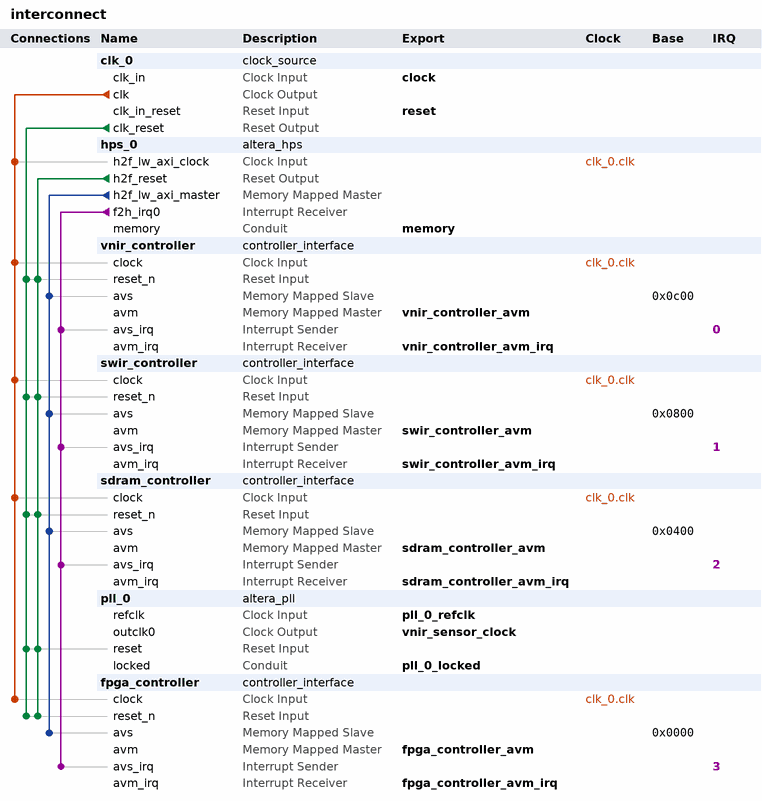
[diagram p0: system contents]
# Platform Designer (Qsys) system interconnect, Cyclone V 5CSXFC6D6F31C6
# Parameters at their usual value, and those the tool derives, are not listed.
package require -exact qsys 17.0
create_system interconnect
set_project_property DEVICE_FAMILY {Cyclone V}
set_project_property DEVICE 5CSXFC6D6F31C6

add_instance clk_0 clock_source 17.0
set_instance_parameter_value clk_0 clockFrequency 50000000

add_instance hps_0 altera_hps 17.0
set_instance_parameter_value hps_0 EMAC1_Mode N/A
set_instance_parameter_value hps_0 EMAC1_PinMuxing Unused
set_instance_parameter_value hps_0 F2SCLK_COLDRST_Enable false
set_instance_parameter_value hps_0 F2SCLK_DBGRST_Enable false
set_instance_parameter_value hps_0 F2SCLK_WARMRST_Enable false
set_instance_parameter_value hps_0 F2SINTERRUPT_Enable true
set_instance_parameter_value hps_0 F2S_Width 0
set_instance_parameter_value hps_0 FPGA_PERIPHERAL_OUTPUT_CLOCK_FREQ_EMAC0_GTX_CLK 125
set_instance_parameter_value hps_0 FPGA_PERIPHERAL_OUTPUT_CLOCK_FREQ_EMAC0_MD_CLK 2.5
set_instance_parameter_value hps_0 FPGA_PERIPHERAL_OUTPUT_CLOCK_FREQ_EMAC1_GTX_CLK 125
set_instance_parameter_value hps_0 FPGA_PERIPHERAL_OUTPUT_CLOCK_FREQ_EMAC1_MD_CLK 2.5
set_instance_parameter_value hps_0 HPS_PROTOCOL DDR3
set_instance_parameter_value hps_0 I2C0_Mode N/A
set_instance_parameter_value hps_0 I2C0_PinMuxing Unused
set_instance_parameter_value hps_0 I2C1_Mode N/A
set_instance_parameter_value hps_0 I2C1_PinMuxing Unused
set_instance_parameter_value hps_0 LWH2F_Enable true
set_instance_parameter_value hps_0 MEM_BANKADDR_WIDTH 3
set_instance_parameter_value hps_0 MEM_CLK_FREQ 400.0
set_instance_parameter_value hps_0 MEM_COL_ADDR_WIDTH 10
set_instance_parameter_value hps_0 MEM_DQ_WIDTH 32
set_instance_parameter_value hps_0 MEM_DRV_STR RZQ/7
set_instance_parameter_value hps_0 MEM_ROW_ADDR_WIDTH 15
set_instance_parameter_value hps_0 MEM_RTT_NOM RZQ/4
set_instance_parameter_value hps_0 MEM_RTT_WR RZQ/4
set_instance_parameter_value hps_0 MEM_TCL 11
set_instance_parameter_value hps_0 MEM_TFAW_NS 30.0
set_instance_parameter_value hps_0 MEM_TRAS_NS 35.0
set_instance_parameter_value hps_0 MEM_TRCD_NS 13.75
set_instance_parameter_value hps_0 MEM_TRFC_NS 260.0
set_instance_parameter_value hps_0 MEM_TRP_NS 13.75
set_instance_parameter_value hps_0 MEM_VENDOR Other
set_instance_parameter_value hps_0 MEM_WTCL 8
set_instance_parameter_value hps_0 QSPI_Mode N/A
set_instance_parameter_value hps_0 QSPI_PinMuxing Unused
set_instance_parameter_value hps_0 REF_CLK_FREQ 25.0
set_instance_parameter_value hps_0 S2FCLK_USER2CLK 5
set_instance_parameter_value hps_0 S2F_Width 0
set_instance_parameter_value hps_0 SDIO_Mode N/A
set_instance_parameter_value hps_0 SDIO_PinMuxing Unused
set_instance_parameter_value hps_0 SPIM1_Mode N/A
set_instance_parameter_value hps_0 SPIM1_PinMuxing Unused
set_instance_parameter_value hps_0 STM_Enable false
set_instance_parameter_value hps_0 TIMING_BOARD_AC_SKEW 0.02
set_instance_parameter_value hps_0 TIMING_BOARD_AC_TO_CK_SKEW 0.01
set_instance_parameter_value hps_0 TIMING_BOARD_DQ_TO_DQS_SKEW 0.05
set_instance_parameter_value hps_0 TIMING_BOARD_MAX_CK_DELAY 0.03
set_instance_parameter_value hps_0 TIMING_BOARD_MAX_DQS_DELAY 0.02
set_instance_parameter_value hps_0 TIMING_BOARD_SKEW_BETWEEN_DQS 0.06
set_instance_parameter_value hps_0 TIMING_BOARD_SKEW_CKDQS_DIMM_MAX 0.12
set_instance_parameter_value hps_0 TIMING_BOARD_SKEW_CKDQS_DIMM_MIN 0.06
set_instance_parameter_value hps_0 TIMING_BOARD_SKEW_WITHIN_DQS 0.01
set_instance_parameter_value hps_0 TIMING_TDH 5
set_instance_parameter_value hps_0 TIMING_TDQSCK 255
set_instance_parameter_value hps_0 TIMING_TDQSQ 125
set_instance_parameter_value hps_0 TIMING_TDS 30
set_instance_parameter_value hps_0 TIMING_TIH 140
set_instance_parameter_value hps_0 TIMING_TIS 180
set_instance_parameter_value hps_0 TIMING_TQSH 0.4
set_instance_parameter_value hps_0 UART0_Mode N/A
set_instance_parameter_value hps_0 UART0_PinMuxing Unused
set_instance_parameter_value hps_0 USB1_Mode N/A
set_instance_parameter_value hps_0 USB1_PinMuxing Unused
set_instance_parameter_value hps_0 desired_cfg_clk_mhz 100.0
set_instance_parameter_value hps_0 desired_qspi_clk_mhz 400.0
set_instance_parameter_value hps_0 use_default_mpu_clk false

add_instance vnir_controller controller_interface 1.0

add_instance swir_controller controller_interface 1.0

add_instance sdram_controller controller_interface 1.0

add_instance pll_0 altera_pll 17.0
set_instance_parameter_value pll_0 gui_device_speed_grade 1
set_instance_parameter_value pll_0 gui_number_of_clocks 1
set_instance_parameter_value pll_0 gui_operation_mode direct
set_instance_parameter_value pll_0 gui_output_clock_frequency0 48.0
set_instance_parameter_value pll_0 gui_pll_auto_reset On
set_instance_parameter_value pll_0 gui_pll_mode {Integer-N PLL}
set_instance_parameter_value pll_0 gui_reference_clock_frequency 50.0
set_instance_parameter_value pll_0 gui_use_locked true

add_instance fpga_controller controller_interface 1.0

# connections
add_connection clk_0.clk fpga_controller.clock clock
add_connection clk_0.clk hps_0.h2f_lw_axi_clock clock
add_connection clk_0.clk sdram_controller.clock clock
add_connection clk_0.clk swir_controller.clock clock
add_connection clk_0.clk vnir_controller.clock clock
add_connection clk_0.clk_reset fpga_controller.reset_n reset
add_connection clk_0.clk_reset pll_0.reset reset
add_connection clk_0.clk_reset sdram_controller.reset_n reset
add_connection clk_0.clk_reset swir_controller.reset_n reset
add_connection clk_0.clk_reset vnir_controller.reset_n reset
add_connection hps_0.h2f_reset fpga_controller.reset_n reset
add_connection hps_0.h2f_reset pll_0.reset reset
add_connection hps_0.h2f_reset sdram_controller.reset_n reset
add_connection hps_0.h2f_reset swir_controller.reset_n reset
add_connection hps_0.h2f_reset vnir_controller.reset_n reset
add_connection hps_0.h2f_lw_axi_master fpga_controller.avs avalon
set_connection_parameter_value hps_0.h2f_lw_axi_master/fpga_controller.avs baseAddress 0x0000
add_connection hps_0.h2f_lw_axi_master sdram_controller.avs avalon
set_connection_parameter_value hps_0.h2f_lw_axi_master/sdram_controller.avs baseAddress 0x0400
add_connection hps_0.h2f_lw_axi_master swir_controller.avs avalon
set_connection_parameter_value hps_0.h2f_lw_axi_master/swir_controller.avs baseAddress 0x0800
add_connection hps_0.h2f_lw_axi_master vnir_controller.avs avalon
set_connection_parameter_value hps_0.h2f_lw_axi_master/vnir_controller.avs baseAddress 0x0c00
add_connection hps_0.f2h_irq0 fpga_controller.avs_irq interrupt
set_connection_parameter_value hps_0.f2h_irq0/fpga_controller.avs_irq irqNumber 3
add_connection hps_0.f2h_irq0 sdram_controller.avs_irq interrupt
set_connection_parameter_value hps_0.f2h_irq0/sdram_controller.avs_irq irqNumber 2
add_connection hps_0.f2h_irq0 swir_controller.avs_irq interrupt
set_connection_parameter_value hps_0.f2h_irq0/swir_controller.avs_irq irqNumber 1
add_connection hps_0.f2h_irq0 vnir_controller.avs_irq interrupt
set_connection_parameter_value hps_0.f2h_irq0/vnir_controller.avs_irq irqNumber 0

# exported interfaces
add_interface clock clock sink
set_interface_property clock EXPORT_OF clk_0.clk_in
add_interface fpga_controller_avm avalon master
set_interface_property fpga_controller_avm EXPORT_OF fpga_controller.avm
add_interface fpga_controller_avm_irq interrupt receiver
set_interface_property fpga_controller_avm_irq EXPORT_OF fpga_controller.avm_irq
add_interface memory conduit end
set_interface_property memory EXPORT_OF hps_0.memory
add_interface pll_0_locked conduit end
set_interface_property pll_0_locked EXPORT_OF pll_0.locked
add_interface pll_0_refclk clock sink
set_interface_property pll_0_refclk EXPORT_OF pll_0.refclk
add_interface reset reset sink
set_interface_property reset EXPORT_OF clk_0.clk_in_reset
add_interface sdram_controller_avm avalon master
set_interface_property sdram_controller_avm EXPORT_OF sdram_controller.avm
add_interface sdram_controller_avm_irq interrupt receiver
set_interface_property sdram_controller_avm_irq EXPORT_OF sdram_controller.avm_irq
add_interface swir_controller_avm avalon master
set_interface_property swir_controller_avm EXPORT_OF swir_controller.avm
add_interface swir_controller_avm_irq interrupt receiver
set_interface_property swir_controller_avm_irq EXPORT_OF swir_controller.avm_irq
add_interface vnir_controller_avm avalon master
set_interface_property vnir_controller_avm EXPORT_OF vnir_controller.avm
add_interface vnir_controller_avm_irq interrupt receiver
set_interface_property vnir_controller_avm_irq EXPORT_OF vnir_controller.avm_irq
add_interface vnir_sensor_clock clock source
set_interface_property vnir_sensor_clock EXPORT_OF pll_0.outclk0

set_interconnect_requirement {$system} qsys_mm.clockCrossingAdapter HANDSHAKE
set_interconnect_requirement {$system} qsys_mm.enableEccProtection FALSE
set_interconnect_requirement {$system} qsys_mm.insertDefaultSlave FALSE
set_interconnect_requirement {$system} qsys_mm.maxAdditionalLatency 1

save_system interconnect.qsys
